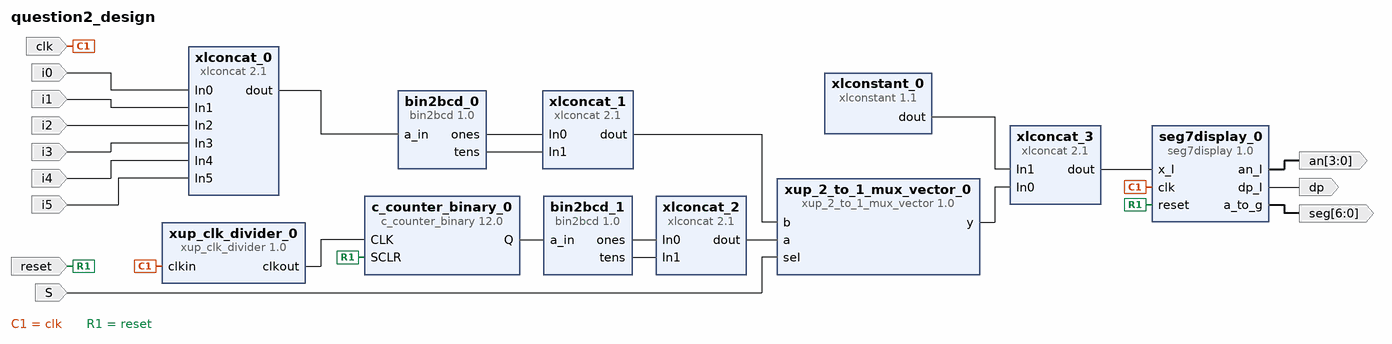
[diagram p0: block diagram of the top level]
# Vivado block design question2_design, xc7a35tcpg236-1, Vivado 2023.1
create_bd_design question2_design

create_bd_port -dir I i0
create_bd_port -dir I i1
create_bd_port -dir I i2
create_bd_port -dir I i3
create_bd_port -dir I i4
create_bd_port -dir I i5
create_bd_port -dir I S
create_bd_port -dir I clk
create_bd_port -dir I reset
create_bd_port -dir O -from 3 -to 0 an
create_bd_port -dir O -from 6 -to 0 seg
create_bd_port -dir O dp

create_bd_cell -type ip -vlnv xilinx.com:XUP:bin2bcd:1.0 bin2bcd_0
set_property -dict {CONFIG.SIZE 6} [get_bd_cells bin2bcd_0]
create_bd_cell -type ip -vlnv xilinx.com:ip:xlconcat:2.1 xlconcat_0
set_property -dict {CONFIG.NUM_PORTS 6} [get_bd_cells xlconcat_0]
create_bd_cell -type ip -vlnv xilinx.com:ip:xlconcat:2.1 xlconcat_1
set_property -dict {CONFIG.IN0_WIDTH 4 CONFIG.IN1_WIDTH 4} [get_bd_cells xlconcat_1]
create_bd_cell -type ip -vlnv xilinx.com:XUP:xup_clk_divider:1.0 xup_clk_divider_0
set_property -dict {CONFIG.SIZE 100000000} [get_bd_cells xup_clk_divider_0]
create_bd_cell -type ip -vlnv xilinx.com:ip:c_counter_binary:12.0 c_counter_binary_0
set_property -dict [list \
  CONFIG.Final_Count_Value 40 \
  CONFIG.Output_Width 7 \
  CONFIG.Restrict_Count true \
  CONFIG.SCLR true \
] [get_bd_cells c_counter_binary_0]
create_bd_cell -type ip -vlnv xilinx.com:XUP:bin2bcd:1.0 bin2bcd_1
set_property -dict {CONFIG.SIZE 7} [get_bd_cells bin2bcd_1]
create_bd_cell -type ip -vlnv xilinx.com:ip:xlconcat:2.1 xlconcat_2
set_property -dict {CONFIG.IN0_WIDTH 4 CONFIG.IN1_WIDTH 4} [get_bd_cells xlconcat_2]
create_bd_cell -type ip -vlnv xilinx.com:XUP:xup_2_to_1_mux_vector:1.0 xup_2_to_1_mux_vector_0
set_property -dict {CONFIG.SIZE 8} [get_bd_cells xup_2_to_1_mux_vector_0]
create_bd_cell -type ip -vlnv xilinx.com:XUP:seg7display:1.0 seg7display_0
create_bd_cell -type ip -vlnv xilinx.com:ip:xlconcat:2.1 xlconcat_3
set_property -dict {CONFIG.IN0_WIDTH 8 CONFIG.IN1_WIDTH 8} [get_bd_cells xlconcat_3]
create_bd_cell -type ip -vlnv xilinx.com:ip:xlconstant:1.1 xlconstant_0
set_property -dict {CONFIG.CONST_VAL 0 CONFIG.CONST_WIDTH 8} [get_bd_cells xlconstant_0]

# ---- connections ----

connect_bd_net [get_bd_ports S] [get_bd_pins xup_2_to_1_mux_vector_0/sel]
connect_bd_net [get_bd_pins bin2bcd_0/ones] [get_bd_pins xlconcat_1/In0]
connect_bd_net [get_bd_pins bin2bcd_0/tens] [get_bd_pins xlconcat_1/In1]
connect_bd_net [get_bd_pins bin2bcd_1/ones] [get_bd_pins xlconcat_2/In0]
connect_bd_net [get_bd_pins bin2bcd_1/tens] [get_bd_pins xlconcat_2/In1]
connect_bd_net [get_bd_pins c_counter_binary_0/Q] [get_bd_pins bin2bcd_1/a_in]
connect_bd_net [get_bd_ports clk] [get_bd_pins xup_clk_divider_0/clkin] [get_bd_pins seg7display_0/clk]
connect_bd_net -net i0_1 [get_bd_ports i0] [get_bd_pins xlconcat_0/In0]
connect_bd_net -net i1_1 [get_bd_ports i1] [get_bd_pins xlconcat_0/In1]
connect_bd_net -net i2_1 [get_bd_ports i2] [get_bd_pins xlconcat_0/In2]
connect_bd_net -net i3_1 [get_bd_ports i3] [get_bd_pins xlconcat_0/In3]
connect_bd_net -net i4_1 [get_bd_ports i4] [get_bd_pins xlconcat_0/In4]
connect_bd_net -net i5_1 [get_bd_ports i5] [get_bd_pins xlconcat_0/In5]
connect_bd_net [get_bd_ports reset] [get_bd_pins seg7display_0/reset] [get_bd_pins c_counter_binary_0/SCLR]
connect_bd_net [get_bd_pins seg7display_0/a_to_g] [get_bd_ports seg]
connect_bd_net [get_bd_pins seg7display_0/an_l] [get_bd_ports an]
connect_bd_net [get_bd_pins seg7display_0/dp_l] [get_bd_ports dp]
connect_bd_net [get_bd_pins xlconcat_0/dout] [get_bd_pins bin2bcd_0/a_in]
connect_bd_net [get_bd_pins xlconcat_1/dout] [get_bd_pins xup_2_to_1_mux_vector_0/b]
connect_bd_net [get_bd_pins xlconcat_2/dout] [get_bd_pins xup_2_to_1_mux_vector_0/a]
connect_bd_net [get_bd_pins xlconcat_3/dout] [get_bd_pins seg7display_0/x_l]
connect_bd_net [get_bd_pins xlconstant_0/dout] [get_bd_pins xlconcat_3/In1]
connect_bd_net [get_bd_pins xup_2_to_1_mux_vector_0/y] [get_bd_pins xlconcat_3/In0]
connect_bd_net [get_bd_pins xup_clk_divider_0/clkout] [get_bd_pins c_counter_binary_0/CLK]

validate_bd_design
save_bd_design
